# Altium schematic sheet InWall_Schem2.SchDoc
size A4; SheetNumber: 1; SheetTotal: 1
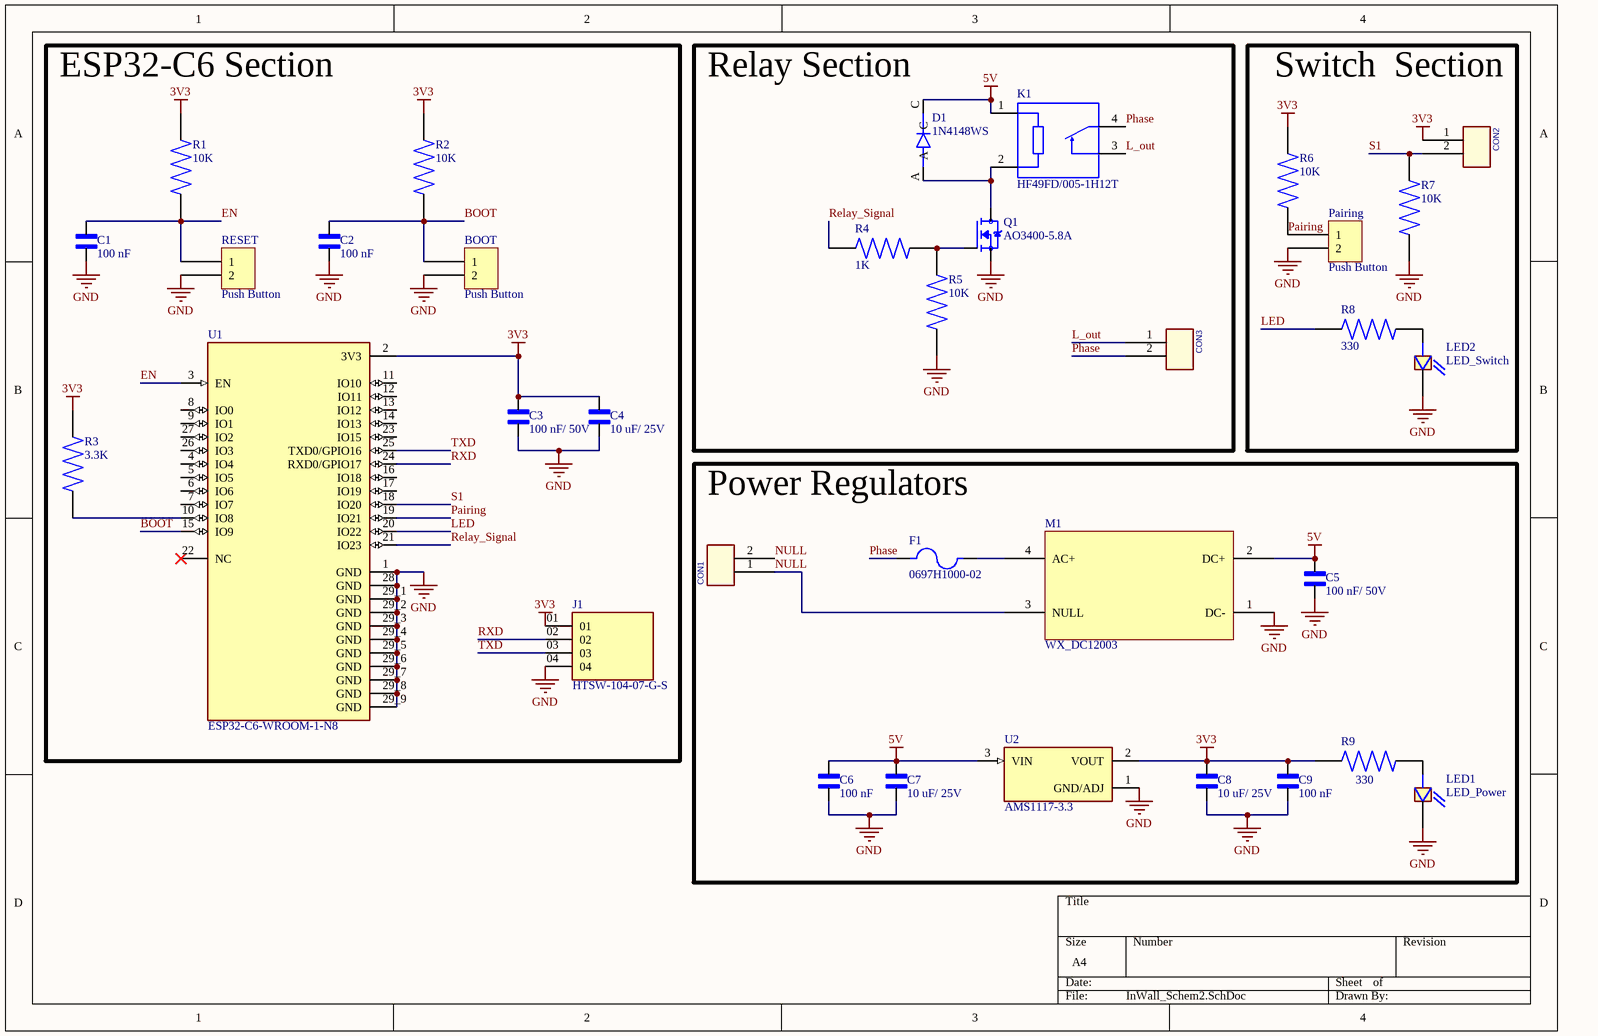
[diagram p0: InWall_Schem2.SchDoc]

## Parts
BOOT  Push Button  [Push Button]
C1  100 nF  [CAPC2012X90N]
C2  100 nF  [CAPC2012X90N]
C3  100 nF/ 50V  [CAPC2012X90N]
C4  10 uF/ 25V  [CAPC2012X90N]
C5  100 nF/ 50V  [CAPC2012X90N]
C6  100 nF  [CAPC2012X90N]
C7  10 uF/ 25V  [CAPC2012X90N]
C8  10 uF/ 25V  [CAPC2012X90N]
C9  100 nF  [CAPC2012X90N]
CON1  CON2  [TB_2]  (value not drawn)
CON2  CON2  [TB_2]  (value not drawn)
CON3  CON2  [TB_2]  (value not drawn)
D1  1N4148WS  [SODFL2512X100N]
F1  0697H1000-02  [FUSRR508W60L835T400H810]
J1  HTSW-104-07-G-S  [SAMTEC_HTSW-104-07-G-S]
K1  HF49FD/005-1H12T  [RELAY_HF49FD/005-1H12T]
LED1  LED_Power  [LEDRD254W50D305H520P]
LED2  LED_Switch  [LEDRD254W50D305H520P]
M1  WX_DC12003  [WX-DC12003]
Pairing  Push Button  [Push Button]
Q1  AO3400-5.8A  [SOT95P260X140-3N]
R1  10K  [RESC2012X65N]
R2  10K  [RESC2012X65N]
R3  3.3K  [RESC2012X65N]
R4  1K  [RESC2012X65N]
R5  10K  [RESC2012X65N]
R6  10K  [RESC2012X65N]
R7  10K  [RESC2012X65N]
R8  330  [RESC2012X65N]
R9  330  [RESC2012X65N]
RESET  Push Button  [Push Button]
U1  ESP32-C6-WROOM-1-N8  [XCVR_ESP32-C6-WROOM-1-N8]
U2  AMS1117-3.3  [SOT229P700X180-4N]

## Blocks framed on the sheet
ESP32-C6 Section: BOOT C1-C4 J1 R1-R3 RESET U1
Relay Section: CON3 D1 K1 Q1 R4 R5
Switch  Section: CON2 LED2 Pairing R6-R8
Power Regulators: C5-C9 CON1 F1 LED1 M1 R9 U2

## Nets
3V3: C3.2 C4.2 C8.2 C9.2 CON2.1 J1.01 R1.1 R2.1 R3.2 R6.1 R9.1 U1.2(3V3) U2.2(VOUT)
5V: C5.2 C6.2 C7.2 D1.C K1.1(L1) M1.2(DC+) U2.3(VIN)
GND: BOOT.2 C1.1 C2.1 C3.1 C4.1 C5.1 C6.1 C7.1 C8.1 C9.1 J1.04 LED1.C LED2.C M1.1(DC-) Pairing.2 Q1.2(S) R5.1 R7.2 RESET.2 U1.1(GND) U1.28(GND) U1.29_1(GND) U1.29_2(GND) U1.29_3(GND) U1.29_4(GND) U1.29_5(GND) U1.29_6(GND) U1.29_7(GND) U1.29_8(GND) U1.29_9(GND) U2.1(GND/ADJ)
BOOT: BOOT.1 C2.2 R2.2 U1.15(IO9)
EN: C1.2 R1.2 RESET.1 U1.3(EN)
L_out: CON3.1 K1.3(C2)
LED: R8.1 U1.20(IO22)
NULL: CON1.1 CON1.2 M1.3(NULL)
Pairing: Pairing.1 R6.2 U1.19(IO21)
Phase: CON3.2 F1.1 K1.4(C1)
Relay_Signal: R4.1 U1.21(IO23)
RXD: J1.02 U1.24(RXD0/GPIO17)
S1: CON2.2 R7.1 U1.18(IO20)
TXD: J1.03 U1.25(TXD0/GPIO16)
NetD1_A: D1.A K1.2(L2) Q1.3(D)
NetF1_2: F1.2 M1.4(AC+)
NetLED1_A: LED1.A R9.2
NetLED2_A: LED2.A R8.2
NetQ1_1: Q1.1(G) R4.2 R5.2
NetR3_1: R3.1 U1.10(IO8)

Not connected (* = marked no-connect by the designer): U1 4(IO4) 5(IO5) 6(IO6) 7(IO7) 8(IO0) 9(IO1) 11(IO10) 12(IO11) 13(IO12) 14(IO13) 16(IO18) 17(IO19) 22(NC)* 23(IO15) 26(IO3) 27(IO2)

## Library data of the parts
C1-C9 = VJ0805Y104KXXCW1BC: Capacitor: ceramic; MLCC; 100nF; 25V; X7R; Â±10%; SMD; 0805; MF: Vishay Vitramon; SnapEDA_Link: https://www.snapeda.com/parts/VJ0805Y104KXXCW1BC/Vishay/view-part/?ref=snap; Package: 0805-2 VISHAY; Value: *; MP: VJ0805Y104KXXCW1BC; Check_prices: https://www.snapeda.com/parts/VJ0805Y104KXXCW1BC/Vishay/view-part/?ref=eda
D1 = 1N4148WS: Diode Standard 75V 300mA (DC) Surface Mount SOD-323; MF: ON Semiconductor; Purchase-URL: https://pricing.snapeda.com/search/part/1N4148WS/?ref=eda; Value: *; Package: SOD-323FL-2 ON Semiconductor; Availability: In Stock; Price: None; MP: 1N4148WS
F1 = 0697H1000-02: 2-Pin Radial Fuse | Rectangular | Slow Blow | UL | Ammo Pack | 1A; MF: Bel Fuse; SnapEDA_Link: https://www.snapeda.com/parts/0697H1000-02/Bel+Circuit+Protection/view-part/?ref=snap; Package: Radial Box  Bel Fuse; Value: *; MP: 0697H1000-02; Check_prices: https://www.snapeda.com/parts/0697H1000-02/Bel+Circuit+Protection/view-part/?ref=eda
K1 = HF49FD/005-1H12T: Relay: electromagnetic; SPST-NO; Ucoil: 5VDC; 5A/250VAC; 5A/30VDC; MF: Hongfa; Price: None; SnapEDA_Link: https://www.snapeda.com/parts/HF49FD/005-1H12T/Hongfa/view-part/2753221/?ref=snap; MP: HF49FD/005-1H12T; Value: *; Availability: Unavailable; Package: None
LED1 LED2 = OVLAW4CB7: Ovlaw4Cb7 White LED 3mm (T-1) Round Lens Through Hole Package | Optek (TT Electronics) OVLAW4CB7; MF: TT Electronics/Optek; SnapEDA_Link: https://www.snapeda.com/parts/OVLAW4CB7/TT+Electronics%252FOptek/view-part/?ref=snap; Package: Package; Value: *; MP: OVLAW4CB7; Check_prices: https://www.snapeda.com/parts/OVLAW4CB7/TT+Electronics%252FOptek/view-part/?ref=eda
Q1 = AO3400-5.8A: MF: {'manufacturer': u'MDD'}; Package: None; Price: None; Value: *; MP: AO3400-5.8A; Availability: Unavailable
R1-R9 = RN73C2A5K11BTD: RES SMD 5.11KOHM 0.1% 1/10W 0805; Power_Rating: .1 W; Resistance: 5.11K; MF: TE Connectivity; Tolerance: .1%; SnapEDA_Link: https://www.snapeda.com/parts/RN73C2A5K11BTD/TE+Connectivity+Passive+Product/view-part/?ref=snap; Package: 0805; Value: *; MP: RN73C2A5K11BTD; EU_RoHS_Compliance: Compliant; Check_prices: https://www.snapeda.com/parts/RN73C2A5K11BTD/TE+Connectivity+Passive+Product/view-part/?ref=eda
U1 = ESP32-C6-WROOM-1-N8: Multiprotocol Modules ESP32-C6 module, Wi-Fi 6 in 2.4 GHz band, Bluetooth 5, Zigbee 3.0 and Thread. ESP34-WROOM Compatible - ENGINEERING SAMPLE; MF: Espressif Systems; SnapEDA_Link: https://www.snapeda.com/parts/ESP32-C6-WROOM-1-N8/Espressif+Systems/view-part/?ref=snap; Package: SMD-28 Espressif Systems; Value: *; MP: ESP32-C6-WROOM-1-N8; Check_prices: https://www.snapeda.com/parts/ESP32-C6-WROOM-1-N8/Espressif+Systems/view-part/?ref=eda
U2 = AMS1117-3.3: Sot223/Pkg 1-Amp 3.3-Volt Low Drop Out Voltage Regulatator; MF: Advanced Monolithic Systems; SnapEDA_Link: https://www.snapeda.com/parts/AMS1117-3.3/Advanced+Monolithic+Systems/view-part/?ref=snap; Package: SOT-223 Seeed Technology; Value: *; MP: AMS1117-3.3; Check_prices: https://www.snapeda.com/parts/AMS1117-3.3/Advanced+Monolithic+Systems/view-part/?ref=eda
J1 = HTSW-104-07-G-S: Availability: Unavailable; Price: None; Package: None; Value: *; MP: HTSW-104-07-G-S